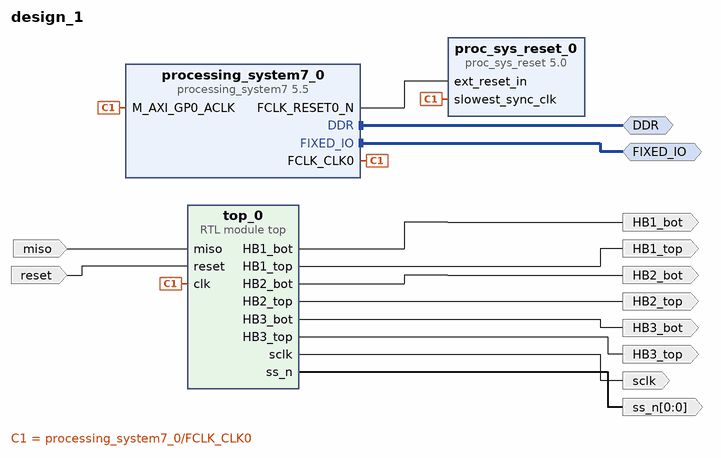
[diagram p0: block diagram of the top level]
# Vivado block design design_1, xc7z020clg484-1, Vivado 2024.1
create_bd_design design_1

create_bd_intf_port -mode Master -vlnv xilinx.com:interface:ddrx_rtl:1.0 DDR
create_bd_intf_port -mode Master -vlnv xilinx.com:display_processing_system7:fixedio_rtl:1.0 FIXED_IO
create_bd_port -dir O HB1_top
create_bd_port -dir O HB1_bot
create_bd_port -dir O HB2_top
create_bd_port -dir O HB2_bot
create_bd_port -dir O HB3_top
create_bd_port -dir O HB3_bot
create_bd_port -dir I -type rst reset
create_bd_port -dir O sclk
create_bd_port -dir O -from 0 -to 0 ss_n
create_bd_port -dir I miso

create_bd_cell -type ip -vlnv xilinx.com:ip:proc_sys_reset:5.0 proc_sys_reset_0
create_bd_cell -type module -reference top top_0
create_bd_cell -type ip -vlnv xilinx.com:ip:processing_system7:5.5 processing_system7_0
set_property -dict [list \
  CONFIG.PCW_ENET0_PERIPHERAL_ENABLE 0 \
  CONFIG.PCW_FPGA0_PERIPHERAL_FREQMHZ 50 \
  CONFIG.PCW_PRESET_BANK1_VOLTAGE {LVCMOS 1.8V} \
  CONFIG.PCW_SD0_GRP_CD_ENABLE 1 \
  CONFIG.PCW_SD0_GRP_CD_IO {MIO 47} \
  CONFIG.PCW_SD0_GRP_WP_ENABLE 0 \
  CONFIG.PCW_SD0_PERIPHERAL_ENABLE 1 \
  CONFIG.PCW_SD0_SD0_IO {MIO 40 .. 45} \
  CONFIG.PCW_SDIO_PERIPHERAL_FREQMHZ 100 \
  CONFIG.PCW_UIPARAM_DDR_BUS_WIDTH {16 Bit} \
  CONFIG.PCW_UIPARAM_DDR_PARTNO {MT41K256M16 RE-125} \
  CONFIG.PCW_USB0_PERIPHERAL_ENABLE 0 \
] [get_bd_cells processing_system7_0]
# 66 more settings of processing_system7_0 are not shown: defaults, MIO pin electricals, DDR timing, and values the tool derives

# ---- connections ----

connect_bd_intf_net [get_bd_intf_ports DDR] [get_bd_intf_pins processing_system7_0/DDR]
connect_bd_intf_net [get_bd_intf_ports FIXED_IO] [get_bd_intf_pins processing_system7_0/FIXED_IO]
connect_bd_net -net miso_0_1 [get_bd_ports miso] [get_bd_pins top_0/miso]
connect_bd_net [get_bd_pins processing_system7_0/FCLK_CLK0] \
  [get_bd_pins proc_sys_reset_0/slowest_sync_clk] [get_bd_pins top_0/clk] [get_bd_pins processing_system7_0/M_AXI_GP0_ACLK]
connect_bd_net [get_bd_pins processing_system7_0/FCLK_RESET0_N] [get_bd_pins proc_sys_reset_0/ext_reset_in]
connect_bd_net -net reset_0_1 [get_bd_ports reset] [get_bd_pins top_0/reset]
connect_bd_net [get_bd_pins top_0/HB1_bot] [get_bd_ports HB1_bot]
connect_bd_net [get_bd_pins top_0/HB1_top] [get_bd_ports HB1_top]
connect_bd_net [get_bd_pins top_0/HB2_bot] [get_bd_ports HB2_bot]
connect_bd_net [get_bd_pins top_0/HB2_top] [get_bd_ports HB2_top]
connect_bd_net [get_bd_pins top_0/HB3_bot] [get_bd_ports HB3_bot]
connect_bd_net [get_bd_pins top_0/HB3_top] [get_bd_ports HB3_top]
connect_bd_net [get_bd_pins top_0/sclk] [get_bd_ports sclk]
connect_bd_net [get_bd_pins top_0/ss_n] [get_bd_ports ss_n]
set_property PFM.CLOCK {FCLK_CLK0 {id "2" is_default "true" proc_sys_reset "/proc_sys_reset_0" status "fixed" freq_hz "50000000"}} [get_bd_cells processing_system7_0]

validate_bd_design
save_bd_design
